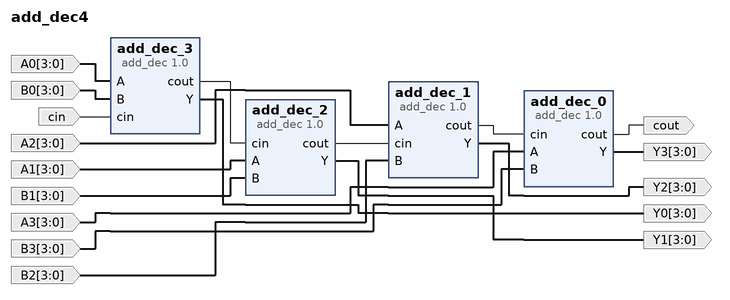
[diagram p0: block diagram of the top level]
# Vivado block design add_dec4, xc7z020clg484-2, Vivado 2024.1
create_bd_design add_dec4

create_bd_port -dir I -from 3 -to 0 A3
create_bd_port -dir I -from 3 -to 0 B3
create_bd_port -dir O -from 3 -to 0 Y3
create_bd_port -dir O cout
create_bd_port -dir I -from 3 -to 0 A2
create_bd_port -dir I -from 3 -to 0 B2
create_bd_port -dir O -from 3 -to 0 Y2
create_bd_port -dir I -from 3 -to 0 A1
create_bd_port -dir I -from 3 -to 0 B1
create_bd_port -dir O -from 3 -to 0 Y1
create_bd_port -dir I -from 3 -to 0 A0
create_bd_port -dir I -from 3 -to 0 B0
create_bd_port -dir O -from 3 -to 0 Y0
create_bd_port -dir I cin

create_bd_cell -type ip -vlnv xilinx.com:user:add_dec:1.0 add_dec_0
create_bd_cell -type ip -vlnv xilinx.com:user:add_dec:1.0 add_dec_1
create_bd_cell -type ip -vlnv xilinx.com:user:add_dec:1.0 add_dec_2
create_bd_cell -type ip -vlnv xilinx.com:user:add_dec:1.0 add_dec_3

# ---- connections ----

connect_bd_net -net A_0_1 [get_bd_ports A3] [get_bd_pins add_dec_0/A]
connect_bd_net -net A_1_1 [get_bd_ports A2] [get_bd_pins add_dec_1/A]
connect_bd_net -net A_2_1 [get_bd_ports A1] [get_bd_pins add_dec_2/A]
connect_bd_net -net A_3_1 [get_bd_ports A0] [get_bd_pins add_dec_3/A]
connect_bd_net -net B_0_1 [get_bd_ports B3] [get_bd_pins add_dec_0/B]
connect_bd_net -net B_1_1 [get_bd_ports B2] [get_bd_pins add_dec_1/B]
connect_bd_net -net B_2_1 [get_bd_ports B1] [get_bd_pins add_dec_2/B]
connect_bd_net -net B_3_1 [get_bd_ports B0] [get_bd_pins add_dec_3/B]
connect_bd_net [get_bd_pins add_dec_0/Y] [get_bd_ports Y3]
connect_bd_net [get_bd_pins add_dec_0/cout] [get_bd_ports cout]
connect_bd_net [get_bd_pins add_dec_1/Y] [get_bd_ports Y2]
connect_bd_net [get_bd_pins add_dec_1/cout] [get_bd_pins add_dec_0/cin]
connect_bd_net [get_bd_pins add_dec_2/Y] [get_bd_ports Y1]
connect_bd_net [get_bd_pins add_dec_2/cout] [get_bd_pins add_dec_1/cin]
connect_bd_net [get_bd_pins add_dec_3/Y] [get_bd_ports Y0]
connect_bd_net [get_bd_pins add_dec_3/cout] [get_bd_pins add_dec_2/cin]
connect_bd_net -net cin_0_1 [get_bd_ports cin] [get_bd_pins add_dec_3/cin]

validate_bd_design
save_bd_design
